# EAGLE design piezo-preamp-tickler_V3-6_single-supply-OPA1642 (EAGLE 8.6.0)

## Sheet 1 of 2
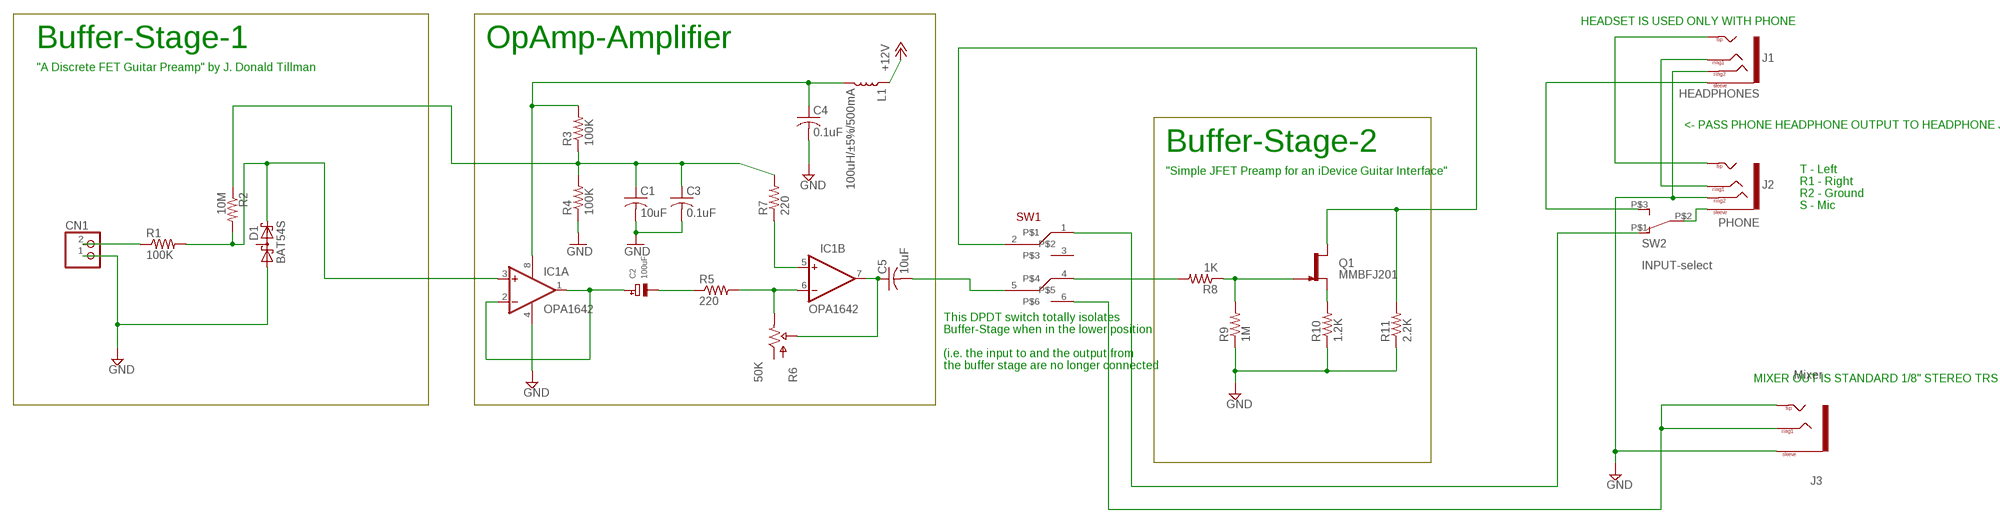
[diagram p0: schematic, sheet 1]

### Parts
C1  10uF  C-USC0805K  [C0805K]
C2  100uF  CAP_TANTALUMD/7343_REFLOW  [EIA7343-31/D-R]
C3  0.1uF  C-USC0805K  [C0805K]
C4  0.1uF  C-USC0805K  [C0805K]
C5  10uF  C-USC0805  [C0805]
CN1  JST_2PIN-THM  [JST-PH-2-THM]
D1  BAT54S  [SOT23]
IC1  OPA1642  OPA2134UA  [SO08]
J1  HEADPHONES  TRRS-1/8"-3.5MMLGPADS  [TRRS_SJ-43514-SMT-TR]
J2  PHONE  TRRS-1/8"-3.5MMLGPADS  [TRRS_SJ-43514-SMT-TR]
J3  Mixer  TRS-1/8"-3.5MM  [TRS_SJ-3524-SMT]
L1  100uH/±5%/500mA  INDUCTOR-0603-33NH  [0603]
Q1  MMBFJ201  J201SOT-23  [SOT23-3]
R1  100K  R-US_R0603  [R0603]
R2  10M  R-US_R0603  [R0603]
R3  100K  R-US_R0603  [R0603]
R4  100K  R-US_R0603  [R0603]
R5  220  R-US_R0603  [R0603]
R6  50K  POTTHUMBPOT14  [THUMBPOT14MM]
R7  220  R-US_R0603  [R0603]
R8  1K  R-US_R0603  [R0603]
R9  1M  R-US_R0603  [R0603]
R10  1.2K  R-US_R0603  [R0603]
R11  2.2K  R-US_R0603  [R0603]
SW1  SWITCH_DPDT  [SWITCH_DPDT_CL-SB-22B]
SW2  INPUT-select  SWITCH_SPDTCL-SB-12B  [SWITCH_SPDT_CL-SB-12B]

### Nets
+12V: L1.1 ; also sheet 2
GND: C1.2 C3.2 C4.2 CN1.1 D1.1(A1) IC1.4(A:V-) J1.RING2 J2.RING2 J3.1(SLEEVE) R4.1 R9.1 R10.1 R11.1 ; also sheet 2
N$1: D1.2(C2) IC1.3(A:+IN) R1.2 R2.2
N$2: CN1.2 R1.1
N$3: Q1.2(S) R10.2
N$4: J1.EARTH(SLEEVE) SW2.P$3
N$5: IC1.5(B:+IN) R7.1
N$6: C5.1 IC1.7(B:OUT) R6.P$2(WIPER)
N$7: IC1.6(B:-IN) R5.2 R6.P$3(OUT)
N$8: C4.1 IC1.8(A:V+) L1.2 R3.2
N$9: C1.1 C3.1 R2.1 R3.1 R4.2 R7.2
N$10: Q1.3(G) R8.1 R9.2
N$11: R8.2 SW1.4
N$12: J3.2(TIP) J3.3(RING1) J3.4(TIP) SW1.6
N$13: J1.RING1 J2.RING1
N$14: C2.- R5.1
N$16: C5.2 SW1.5
N$17: J2.EARTH(SLEEVE) SW2.P$2
N$19: SW1.1 SW2.P$1
N$24: C2.+ IC1.1(A:OUT) IC1.2(A:-IN)
N$33: J1.TIP J2.TIP
SELECT: Q1.1(D) R11.2 SW1.2
Unconnected: D1.3(C1A2) R6.P$1(IN) SW1.3

### Notes on the sheet
- HEADSET IS USED ONLY WITH PHONE
- Buffer-Stage-1 | OpAmp-Amplifier
- "A Discrete FET Guitar Preamp" by J. Donald Tillman
- <- PASS PHONE HEADPHONE OUTPUT TO HEADPHONE JACK
- Buffer-Stage-2
- "Simple JFET Preamp for an iDevice Guitar Interface"
- T - Left
  R1 - Right
  R2 - Ground
  S - Mic
- This DPDT switch totally isolates 
  Buffer-Stage when in the lower position
  
  (i.e. the input to and the output from 
  the buffer stage are no longer connected
- MIXER OUT IS STANDARD 1/8" STEREO TRS

## Sheet 2 of 2
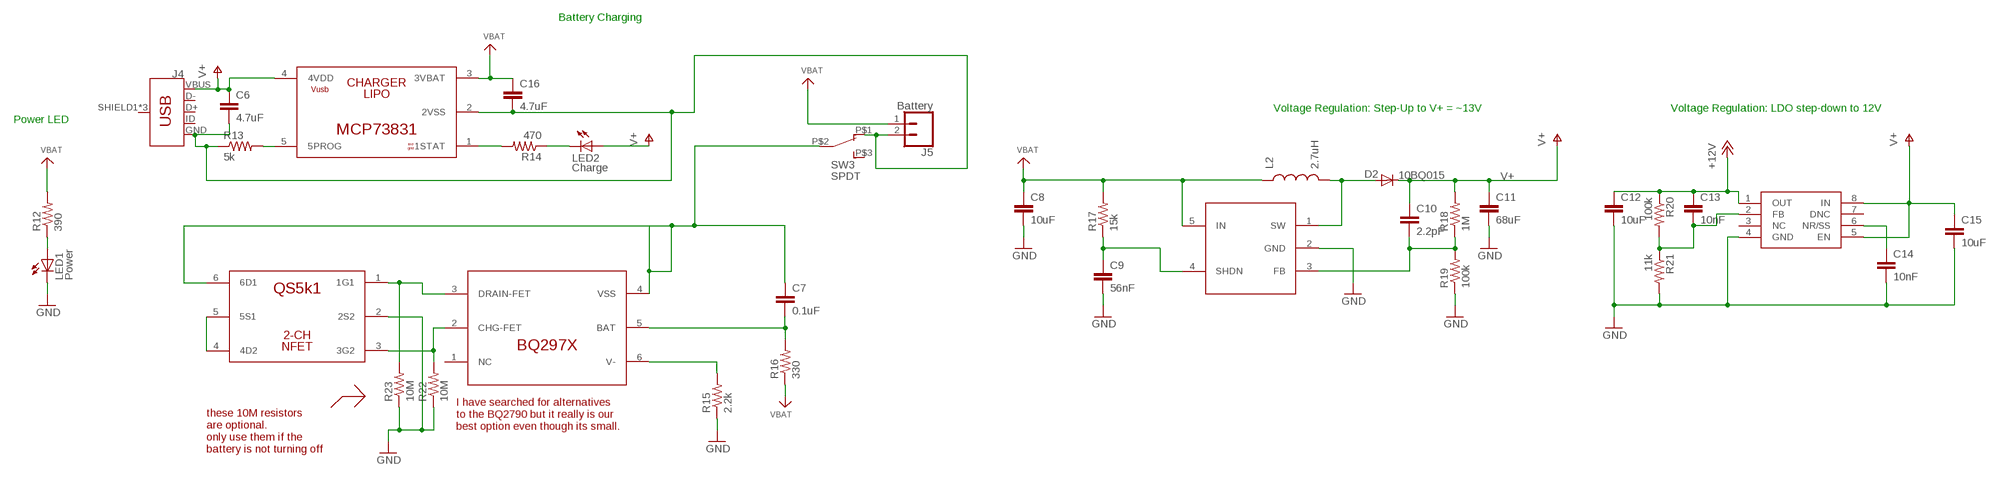
[diagram p1: schematic, sheet 2]

### Parts
C6  4.7uF  C-EUC0603  [C0603]
C7  0.1uF  C-EUC0603  [C0603]
C8  10uF  C-EUC0603  [C0603]
C9  56nF  C-EUC0603  [C0603]
C10  2.2pF  C-EUC0603  [C0603]
C11  68uF  C-EUC1206  [C1206]
C12  10uF  C-EUC0603  [C0603]
C13  10nF  C-EUC0603  [C0603]
C14  10nF  C-EUC0603  [C0603]
C15  10uF  C-EUC0603  [C0603]
C16  4.7uF  C-EUC0603  [C0603]
D2  10BQ015  DIODESMA  [SMA-DIODE]
IC4  BQ297X  BQ297X-BATTERY-MANAGERLONG  [WSON-6-LONG]
IC5  SC4503  [SOT23-5]
IC6  TPS7A49  [MSOP-8]
J4  USB_MICRO-BREDUCED_PASTE  [USB-B-MICRO-SMD_RED_PASTE]
J5  Battery  CONN_02LOCK  [1X02_LOCK]
L2  2.7uH  INDUCTOR30OHM,1.8A  [0603]
LED1  Power  LED3MM  [LED3MM]
LED2  Charge  LED3MM  [LED3MM]
R12  390  R-US_R0603  [R0603]
R13  5k  R-US_R0603  [R0603]
R14  470  R-US_R0603  [R0603]
R15  2.2k  R-US_R0603  [R0603]
R16  330  R-US_R0603  [R0603]
R17  15k  R-US_R0603  [R0603]
R18  1M  R-US_R0603  [R0603]
R19  100k  R-US_R0603  [R0603]
R20  100k  R-US_R0603  [R0603]
R21  11k  R-US_R0603  [R0603]
R22  10M  R-US_R0603  [R0603]
R23  10M  R-US_R0603  [R0603]
SW3  SPDT  SWITCH_SPDTCL-SB-12B  [SWITCH_SPDT_CL-SB-12B]
U$1  MCP73831  [SOT-23-5]
U$2  QS6K1  [SOT457R_PHILIPS]

### Nets
+12V: C12.1 C13.1 IC6.1(OUT) R20.1 ; also sheet 1
BATGND: C7.1 IC4.4(VSS) SW3.P$2 U$2.6(6D1)
GND: C8.2 C9.2 C11.2 C12.2 C14.2 C15.2 IC5.2(GND) IC6.4(GND) LED1.K(C) R15.1 R19.1 R21.2 R22.1 R23.1 U$2.2(2S2) ; also sheet 1
N$18: LED1.A R12.1
N$21: R13.2 U$1.5(5PROG)
N$22: LED2.K(C) R14.1
N$23: U$2.4(4D2) U$2.5(5S1)
N$25: R14.2 U$1.1(1STAT)
N$26: C13.2 IC6.2(FB) R20.2 R21.1
N$27: IC4.3(DRAIN-FET) R23.2 U$2.1(1G1)
N$28: C14.1 IC6.6(NR/SS)
N$29: C9.1 IC5.4(SHDN) R17.1
N$30: C10.2 IC5.3(FB) R18.1 R19.2
N$31: IC4.2(CHG-FET) R22.2 U$2.3(3G2)
N$32: D2.A IC5.1(SW) L2.2
N$34: IC4.6(V-) R15.2
N$42: C7.2 IC4.5(BAT) R16.2
USBGND: C6.2 C16.2 J4.GND J5.2 R13.1 SW3.P$1 U$1.2(2VSS)
V+: C6.1 C10.1 C11.1 C15.1 D2.C IC6.5(EN) IC6.8(IN) J4.VBUS LED2.A R18.2 U$1.4(4VDD)
VBAT: C8.1 C16.1 IC5.5(IN) J5.1 L2.1 R12.2 R16.1 R17.2 U$1.3(3VBAT)
Unconnected: IC4.1(NC) IC6.3(NC) IC6.7(DNC) J4.D+ J4.D- J4.ID J4.SHIELD1(SHIELD) J4.SHIELD2(SHIELD) J4.SHIELD3(SHIELD) SW3.P$3

### Notes on the sheet
- Battery Charging
- Voltage Regulation: Step-Up to V+ = ~13V | Voltage Regulation: LDO step-down to 12V
- Power LED
- I have searched for alternatives 
  to the BQ2790 but it really is our 
  best option even though its small.
- these 10M resistors
  are optional. 
  only use them if the 
  battery is not turning off

## Library data of the parts
C1 C3-C5 = adafruit:C-US: CAPACITOR, American symbol
C2 = microbuilder:CAP_TANTALUM: Tantalum Capacitors Wave footprints have larger pads and are meant to be used for hand soldering. Reflow footprints are optimised for solder paste and a reflow oven. EIA3216-18/A-[R/W] - Size A / 3216-18 / 1206 footprint 4.7µF 25V 10% Tantalum Capacitor 10µF 16V 10% Tantalum Capacitor [Digikey: 495-2236-2-ND] EIA3528-21/B-[R/W] - Size B / 3528-21 47µF 10V 10% Tantalum Capactior [Digikey: 495-2216-1-ND] EIA6032-28/C-[R/W] - Size C / 6032-28 10µF 35V 20% Tantalum Capacitor [Digikey: 495-2285-1-ND] 100µF 16V 10% Tantalum Capactior [Digikey: 399-5214-1-ND]
C6-C16 = rcl:C-EU: CAPACITOR, European symbol; SPICEPREFIX: C
CN1 = adafruit:JST_2PIN: JST 2-Pin Connectors of various flavors SMT-RA (S2B-PH-SM4) 4UConnector #17311 SMT (B2B-PH-SM4) THM-RA (S2B-PH) THM (B2B-PH)
D1 = diode:BAT54S: Schottky Diodes Pin connection corrected 2011-05-04 Source: Fairchild .. BAT54.pdf
D2 = SparkFun:DIODE: Diode These are standard reverse protection diodes and small signal diodes. SMA package can handle up to about 1A. SOD-323 can handle about 200mA. What the SOD-323 package when ordering, there are some mfgs out there that are 5-pin packages.
IC1 = linear:OPA2*: Dual Operational Amplifier Low Power, Single-Supply, Rail-To-Rail Operational Amplifier Source: http://focus.ti.com/lit/ds/symlink/opa2345.pdf http://focus.ti.com .. opa241.pdf http://focus.ti.com/lit/ds/symlink/opa2134.pdf
IC4 = CMU-ArtFab:BQ297X-BATTERY-MANAGER
IC5 = CMU-ArtFab:SC4503
IC6 = CMU-ArtFab:TPS7A49
J1 J2 = CMU-ArtFab:TRRS-1/8"-3.5MM: Audio jack - 3.5mm TRRS variety - two rings.
J3 = CMU-ArtFab:TRS-1/8"-3.5MM
J4 = CMU-ArtFab:USB_MICRO-B: USB Type Micro-B Connector Male/female and PTH/SMT variants SparkFun Products: SparkFun microB USB Breakout <https://www.sparkfun.com/products/12035> SparkFun USB microB Plug Breakout <https://www.sparkfun.com/products/10031> SparkFun ESP8266 Thing <https://www.sparkfun.com/products/13231>; PROD_ID: CONN-11752
J5 = SparkFun-Connectors:CONN_02: Multi connection point. Often used as Generic Header-pin footprint for 0.1 inch spaced/style header connections On any of the 0.1 inch spaced packages, you can populate with these: Break Away Headers - Straight <https://www.sparkfun.com/products/116> (PRT-00116) Break Away Male Headers - Right Angle <https://www.sparkfun.com/products/553> (PRT-00553) Female Headers <https://www.sparkfun.com/products/115> (PRT-00115) Break Away Headers - Machine Pin <https://www.sparkfun.com/products/117> (PRT-00117) Break Away Female Headers - Swiss Machine Pin <https://www.sparkfun.com/products/743> (PRT-00743) For SCREWTERMINALS and SPRING TERMINALS visit here: Screw Terimnals on SparkFun.com <https://www.sparkfun.com/search/results?term=Screw+Terminals> (5mm/3.5mm/2.54mm spacing) This device is also useful as a general connection point to wire up your design to another part of your project. Our various solder wires solder well into these plated through hole pads. Hook-Up Wire - Assortment (Stranded, 22 AWG) <https://www.sparkfun.com/products/11375> (PRT-11375) Hook-Up Wire - Assortment (Solid Core, 22 AWG) <https://www.sparkfun.com/products/11367> (PRT-11367) View the entire wire category on our website here <https://www.sparkfun.com/categories/141> Special notes: Molex polarized connector foot print use with: PRT-08233 with associated crimp pins and housings. 2.54_SCREWTERM for use with PRT-10571. 3.5mm Screw Terminal footprints for PRT-08084 5mm Screw Terminal footprints for use with PRT-08432
L1 = SparkFun-Coils:INDUCTOR: Inductors; PROD_ID: NDUC-07874; VALUE: 33nH/±5%/500mA
L2 = SparkFun-Passives:INDUCTOR: Inductors; PROD_ID: RES-07859
LED1 LED2 = led:LED: LED OSRAM: - CHIPLED LG R971, LG N971, LY N971, LG Q971, LY Q971, LO R971, LY R971 LH N974, LH R974 LS Q976, LO Q976, LY Q976 LO Q996 - Hyper CHIPLED LW Q18S LB Q993, LB Q99A, LB R99A - SideLED LS A670, LO A670, LY A670, LG A670, LP A670 LB A673, LV A673, LT A673, LW A673 LH A674 LY A675 LS A676, LA A676, LO A676, LY A676, LW A676 LS A679, LY A679, LG A679 - Hyper Micro SIDELED® LS Y876, LA Y876, LO Y876, LY Y876 LT Y87S - SmartLED LW L88C, LW L88S LB L89C, LB L89S, LG L890 LS L89K, LO L89K, LY L89K LS L896, LA L896, LO L896, LY L896 - TOPLED LS T670, LO T670, LY T670, LG T670, LP T670 LSG T670, LSP T670, LSY T670, LOP T670, LYG T670 LG T671, LOG T671, LSG T671 LB T673, LV T673, LT T673, LW T673 LH T674 LS T676, LA T676, LO T676, LY T676, LB T676, LH T676, LSB T676, LW T676 LB T67C, LV T67C, LT T67C, LS T67K, LO T67K, LY T67K, LW E67C LS E67B, LA E67B, LO E67B, LY E67B, LB E67C, LV E67C, LT E67C LW T67C LS T679, LY T679, LG T679 LS T770, LO T770, LY T770, LG T770, LP T770 LB T773, LV T773, LT T773, LW T773 LH T774 LS E675, LA E675, LY E675, LS T675 LS T776, LA T776, LO T776, LY T776, LB T776 LHGB T686 LT T68C, LB T68C - Hyper Mini TOPLED® LB M676 - Mini TOPLED Santana® LG M470 LS M47K, LO M47K, LY M47K Source: http://www.osram.convergy.de LUXEON: - LUMILED® LXK2-PW12-R00, LXK2-PW12-S00, LXK2-PW14-U00, LXK2-PW14-V00 LXK2-PM12-R00, LXK2-PM12-S00, LXK2-PM14-U00 LXK2-PE12-Q00, LXK2-PE12-R00, LXK2-PE12-S00, LXK2-PE14-T00, LXK2-PE14-U00 LXK2-PB12-K00, LXK2-PB12-L00, LXK2-PB12-M00, LXK2-PB14-N00, LXK2-PB14-P00, LXK2-PB14-Q00 LXK2-PR12-L00, LXK2-PR12-M00, LXK2-PR14-Q00, LXK2-PR14-R00 LXK2-PD12-Q00, LXK2-PD12-R00, LXK2-PD12-S00 LXK2-PH12-R00, LXK2-PH12-S00 LXK2-PL12-P00, LXK2-PL12-Q00, LXK2-PL12-R00 Source: www.luxeon.com KINGBRIGHT: KA-3528ASYC Source: www.kingbright.com
Q1 = CMU-ArtFab:J201: N-channel JFET
R1-R5 R7-R23 = CMU-ArtFab:R-US_: RESISTOR, American symbol
R6 = CMU-ArtFab:POT: http://www.taydaelectronics.com/10k-ohm-linear-taper-potentiometer-round-shaft-pcb-9mm.html http://www.taydaelectronics.com/datasheets/A-1847.pdf
SW1 = CMU-ArtFab:SWITCH_DPDT
SW2 SW3 = CMU-ArtFab:SWITCH_SPDT
U$1 = CMU-ArtFab:MCP73831
U$2 = CMU-ArtFab:QS6K1

## Board
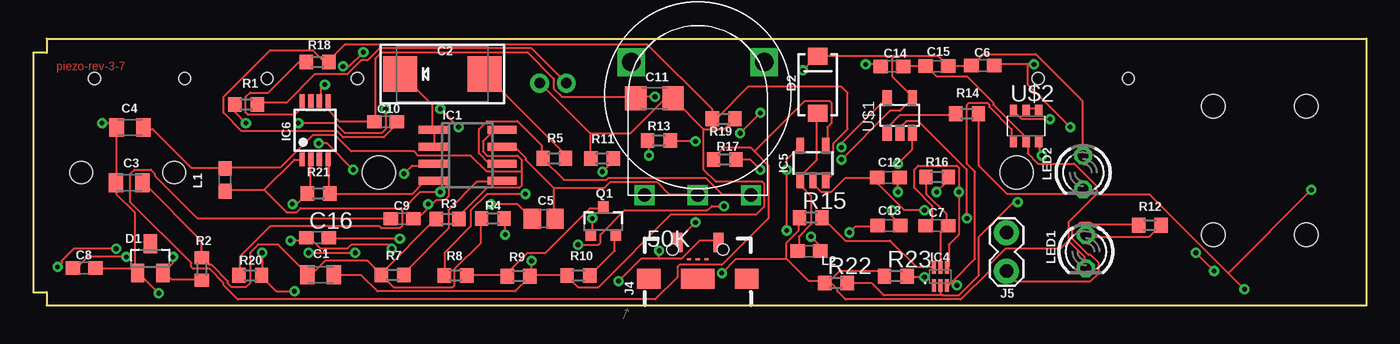
[diagram p2: board, top side]
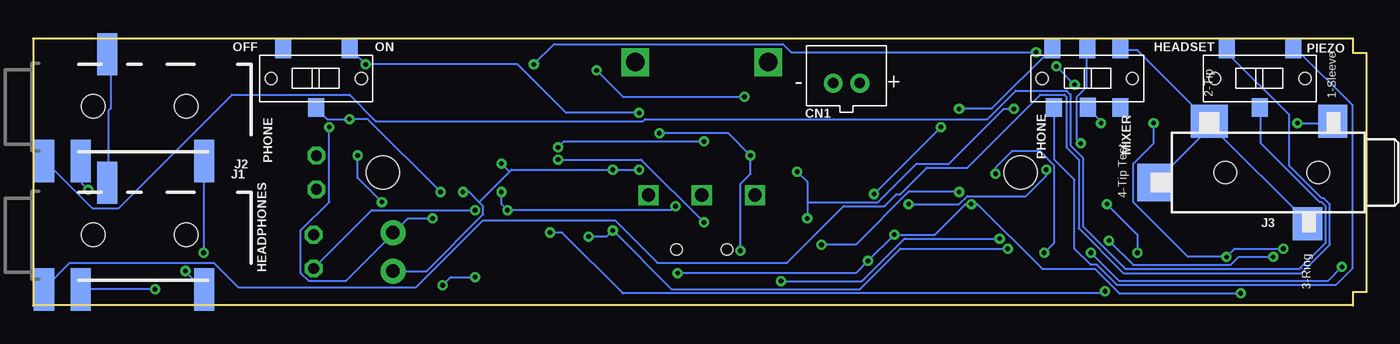
[diagram p3: board, bottom side, seen from below]

Size 100.3 x 20.07 mm. Coordinates in mm from the lower left corner, seen from the top.
Outline: 0,19 0,1 1.02,1 1.02,0 100.3,0 100.3,20.07 1,20.07 1,19 0,19
Copper layers (1*16): Top 0.035mm / dielectric 1.5mm / Bottom 0.035mm
Design rules "default *": minimum track width 6mil, minimum drill 0.35mm, track to track 6mil, track to pad 6mil, pad to pad 6mil, via to via 6mil, smd to smd 6mil, copper to edge 8mil, drill to drill 6mil, minimum pad ring 10mil, minimum via ring 8mil, stop-mask expansion 4mil, vias tented up to drill 20mil, thermal gap 10mil
Holes 2.5 mm at 74,10 26,10

### Footprints (pad centres in the part's own frame; a part is rotated, then mirrored left to right if it is on the bottom)
C0805K = smd 1.1 x 1.4: 1 -1,0; 2 1,0
EIA7343-31/D-R = smd 2.55 x 2.7: + 3.175,0; - -3.175,0
C0805 = smd 1.3 x 1.5: 1 -0.85,0; 2 0.85,0
C0603 = smd 1.1 x 1: 1 -0.85,0; 2 0.85,0
C1206 = smd 1.6 x 1.8: 1 -1.4,0; 2 1.4,0
JST-PH-2-THM = drill 0.8 pad 1.422: 1 1,0; 2 -1,0
SOT23 = smd 1 x 1.4: 1 -0.95,-1.1; 2 0.95,-1.1; 3 0,1.1
SMA-DIODE = smd 1.27 x 1.47: A -2.15,0; C 2.15,0
SO08 = smd 0.6 x 2.2: 1 -1.905,-2.6; 2 -0.635,-2.6; 3 0.635,-2.6; 4 1.905,-2.6; 5 1.905,2.6; 6 0.635,2.6; 7 -0.635,2.6; 8 -1.905,2.6
WSON-6-LONG = smd 0.3 x 0.954: 1 -0.5,-0.686; 2 0,-0.686; 3 0.5,-0.686; 4 0.5,0.686; 5 0,0.686; 6 -0.5,0.686
SOT23-5 = smd 0.55 x 1.2: 1 -0.95,-1.3; 2 0,-1.3; 3 0.95,-1.3; 4 0.95,1.3; 5 -0.95,1.3
MSOP-8 = smd 0.4 x 1: 1 -0.975,-2.2; 2 -0.325,-2.2; 3 0.325,-2.2; 4 0.975,-2.2; 5 0.975,2.2; 6 0.325,2.2; 7 -0.325,2.2; 8 -0.975,2.2
TRRS_SJ-43514-SMT-TR = smd 1.524 x 3.175: EARTH -7.067,-4.128; RING1 -2.309,3.901; RING2 -4.293,-4.128; TIP 4.995,-4.128 | hole 1.778: -3.353,-0.007; 3.647,-0.007
TRS_SJ-3524-SMT = smd 2.5 x 2.2: 1 3.85,-4.6; 3 -3.85,-2.7 | smd 2.5 x 2.8: 2 3.85,4.7 | smd 2.8 x 2.5: 4 -0.75,8.85 | hole 1.7: 0,-3.5; 0,3.5
USB-B-MICRO-SMD_RED_PASTE = smd 0.152 x 0.305: D+ 1.455,0; D- 1.455,0.65; ID 1.455,-0.65 | smd 1.45 x 0.762: GND 2.725,-1.554 | smd 1.5 x 1.8: SHIELD1 0,3.685; SHIELD2 0,-3.685 | smd 1.5 x 2.5: SHIELD3 0,0 | smd 1.45 x 0.781: VBUS 2.725,1.554 | hole 0.85: 2.2,1.9; 2.2,-1.9
1X02_LOCK = drill 1.016 pad 1.88: 1 -0.178,0; 2 2.718,0
0603 = smd 1.1 x 1: 1 -0.85,0; 2 0.85,0
LED3MM = drill 0.813 octagon: A -1.27,0; K 1.27,0
SOT23-3 = smd 0.8 x 0.9: 1 -0.95,-1; 2 0.95,-1; 3 0,1.1
R0603 = smd 1 x 1.1: 1 -0.85,0; 2 0.85,0
THUMBPOT14MM = drill 1 square: P$1 -4,-7.5; P$2 0,-7.5; P$3 4,-7.5 | drill 1.4 square: P$4 -5,2.5; P$5 5,2.5
SWITCH_DPDT_CL-SB-22B = smd 1.2 x 1.4: 1 -2.5,-2.2; 2 0.05,-2.17; 3 2.5,-2.2; 4 -2.63,2.2; 5 0,2.2; 6 2.51,2.2 | hole 0.9: -3.4,0; 3.4,0
SWITCH_SPDT_CL-SB-12B = smd 1.2 x 1.4: P$1 -2.5,-2.2; P$2 0,2.2; P$3 2.5,-2.2 | hole 0.9: -3.4,0; 3.4,0
SOT-23-5 = smd 0.69 x 1.2: 1 -0.95,-1.3; 2 0,-1.3; 3 0.95,-1.3; 4 0.95,1.3; 5 -0.95,1.3
SOT457R_PHILIPS = smd 0.55 x 0.8: 1 -0.95,-1.2; 2 0,-1.2; 3 0.95,-1.2; 4 0.95,1.2; 5 0,1.2; 6 -0.95,1.2

### Placement (x,y rotation side)
C1  21.62,2.31 0 top
C2  30.78,17.41 180 top
C3  7.23,9.23 180 top
C4  7.29,13.38 180 top
C5  38.41,6.53 180 top
C6  71.44,18.04 0 top
C7  68,6 0 top
C8  3.83,2.81 0 top
C9  27.76,6.52 0 top
C10  26.51,13.81 0 top
C11  46.73,15.6 0 top
C12  64.35,9.63 180 top
C13  64.39,6.02 180 top
C14  64.62,17.98 0 top
C15  68,18 180 top
C16  21.4,5.1 0 top
CN1  39.11,16.72 0 bottom
D1  8.81,3.54 0 top
D2  59.04,16.61 90 top
IC1  32.68,11.3 270 top
IC4  68.25,2.19 0 top
IC5  58.67,10.72 0 top
IC6  21.21,13.18 0 top
J1  92.43,5.33 0 bottom
J2  92.43,14.99 0 bottom
J3  7.11,10 90 bottom
J4  50,2.02 90 top
J5  73.23,2.75 90 top
L1  14.44,9.44 90 top
L2  58.37,4.09 180 top
LED1  79.2,4.05 270 top
LED2  79,10 270 top
Q1  42.9,6.3 0 top
R1  16.03,15.11 180 top
R2  12.68,2.74 270 top
R3  31.18,6.51 0 top
R4  34.58,6.54 180 top
R5  39.2,11.07 180 top
R6  50,15.8 0 top
R7  27.04,2.31 180 top
R8  31.78,2.26 180 top
R9  36.52,2.2 180 top
R10  41.02,2.24 0 top
R11  42.79,11.07 0 top
R12  84.02,6.03 180 top
R13  47.08,12.41 0 top
R14  70.26,14.42 180 top
R15  58.5,6.6 0 top
R16  68.01,9.66 180 top
R17  52.03,10.98 0 top
R18  21.39,18.31 180 top
R19  51.95,14.04 180 top
R20  16.34,2.27 0 top
R21  21.47,8.42 0 top
R22  60.4,1.7 0 top
R23  64.9,2.2 0 top
SW1  21,17.08 0 bottom
SW2  8,17.08 180 bottom
SW3  79,17.08 180 bottom
U$1  65.2,14.3 0 top
U$2  74.7,13.5 0 top

### Tracks (layer width: path | path; a pad name or v marks a point on that pad's centre or on a via)
+12V  (via drill 0.35)
  Top 0.152: v65.08,8.53 65.08,9.6 C12.1 | v64.62,7.16 64.62,6.71 65.23,6.1 C13.1 | 17.37,8.69 19.66,10.97 20.12,10.97 IC6.1 | 17.37,8.69 14.48,8.69 L1.1 | 27.74,7.16 27.74,5.94 27.58,5.79 26.21,5.79 26.06,5.94 17.83,5.94 15.54,3.66 15.54,2.29 R20.1 | 27.74,7.16 27.58,7.32 20.12,7.32 19.81,7.01 19.05,7.01 17.37,8.69 | v51.97,7.47 51.05,7.47 50.75,7.16 44.5,7.16 42.67,5.33 42.67,4.72 42.52,4.57 v41,4.57 | v30.63,8.53 29.11,8.53 27.74,7.16
  Bottom 0.152: v65.08,8.53 65.08,7.62 v64.62,7.16 52.27,7.16 v51.97,7.47 | v41,4.57 38.41,4.57 34.44,8.53 v30.63,8.53
BATGND  (via drill 0.35)
  Top 0.152: v76.5,14.02 74.37,14.02 73.76,14.63 U$2.6 | IC4.4 68.89,2.9 68.89,4.57 69.65,5.33 v69.65,8.53 69.65,10.36 69.49,10.52 66.6,10.52 66.29,10.21 66.29,8.84 67.67,7.47 67.67,6.55 67.21,6.1 C7.1
  Bottom 0.152: SW3.P$2 78.94,14.78 78.18,14.02 v76.5,14.02 75.13,14.02 v69.65,8.53
GND  (via drill 0.35)
  Top 0.152: 59.89,1.83 59.59,1.83 R22.1 | 59.89,1.83 60.66,2.59 63.7,2.59 64.01,2.29 R23.1 | 56.69,3.5 56.69,4.72 57.61,5.64 57.61,6.55 R15.1 | 56.69,3.5 58.37,1.83 59.44,1.83 R22.1 | IC5.2 58.52,9.3 59.28,8.53 60.05,8.53 61.11,9.6 63.4,9.6 C12.2 63.55,9.6 63.55,9.14 65.53,7.16 v67.06,7.16 | C14.2 65.53,17.98 67.06,17.98 C15.2 67.21,17.98 67.97,17.22 70.26,17.22 72.24,15.24 72.24,15.09 74.68,12.65 74.68,12.34 U$2.2 74.83,12.19 74.83,11.43 75.59,10.67 78.33,10.67 80.01,8.99 80.01,8.38 | 77.88,4.88 79.1,3.66 79.1,2.9 LED1.K | 77.88,4.88 77.88,6.25 80.01,8.38 | 89.92,2.44 83.97,8.38 80.01,8.38 | 89.92,2.44 v91.14,1.22 | 89.92,2.44 v96.16,8.69 | 59.89,1.83 60.5,1.22 60.5,1.07 61.11,0.46 69.8,0.46 71.93,2.59 71.93,3.05 73.15,4.27 77.27,4.27 77.88,4.88 | 59.89,1.83 R22.1 | 50.44,13.26 51.97,13.26 52.73,14.02 R19.1 | 50.44,13.26 48.16,15.54 C11.2 48.01,15.54 47.55,15.54 44.96,12.95 41.91,12.95 | 41.91,12.95 41.91,11.12 R11.1 | 41.91,12.95 38.25,16.61 CN1.1 | 7.62,2.74 4.72,2.74 C8.2 | 7.62,2.74 7.77,2.59 D1.1 | 7.62,2.74 7.62,7.01 6.25,8.38 6.25,9.14 C3.2 6.25,9.3 6.25,13.26 C4.2 6.25,13.41 5.94,13.72 v5.18,13.72 | 7.62,2.74 D1.1 | IC6.4 22.25,10.97 22.25,8.53 R21.2 22.4,8.38 28.5,8.38 29.41,9.3 30.02,9.3 IC1.4 30.18,9.3 30.79,9.3 31.24,8.84 31.24,8.23 30.94,7.92 30.33,7.92 29.87,7.47 | 29.87,7.47 28.96,6.55 28.65,6.55 C9.2 | 37.49,2.29 40.08,2.29 R10.1 40.23,2.13 41,1.37 42.52,1.37 48.01,6.86 54.41,6.86 55.02,7.47 55.02,9.14 54.86,9.3 51.36,9.3 50.44,10.21 50.44,13.26 | v35.51,5.33 35.51,6.4 R4.1 | 37.49,2.29 v37.49,3.35 | 37.49,2.29 R9.1 37.34,2.13 36.27,1.07 25.91,1.07 24.69,2.29 22.71,2.29 C1.2
  Top 0.152: v29.72,7.62 29.87,7.47 | v9.45,0.91 7.92,2.44 D1.1 | 56.69,3.5 52.88,3.5 v51.82,2.44
  Bottom 0.152: v67.06,7.16 74.83,7.16 79.1,2.9 LED1.K | v91.14,1.22 96.62,1.22 J1.RING2 | v96.16,8.69 96.62,9.14 96.62,10.82 J2.RING2 | v5.18,13.72 2.59,13.72 J3.1 | v9.45,0.91 18.59,0.91 20.42,2.74 24.38,2.74 29.26,7.62 v29.72,7.62 30.18,7.62 32.46,5.33 v35.51,5.33 v37.49,3.35 38.41,2.44 v51.82,2.44
N$1  (via drill 0.35)
  Top 0.152: R2.2 12.65,1.98 10.36,1.98 9.91,2.44 D1.2 9.91,2.59 10.52,3.2 v10.52,3.66 | v16,13.72 15.24,14.48 15.24,15.09 R1.2 | v27.89,9.91 28.5,10.52 30.02,10.52 IC1.3 | v20.73,3.96 v24.23,3.96 | v1.83,2.9 2.13,3.2 2.13,3.35 3.05,4.27 v6.25,4.27
  Bottom 0.152: v16,13.72 16,12.19 17.53,10.67 17.53,7.77 13.41,3.66 v10.52,3.66 9.91,4.27 v6.25,4.27 | v27.89,9.91 27.89,10.36 26.67,11.58 24.54,11.58 23.47,10.52 23.47,4.72 v24.23,3.96 | v20.73,3.96 18.59,1.83 2.9,1.83 v1.83,2.9
N$2
  Top 0.152: R1.1 16.92,15.24 19.05,15.24 21.18,17.37 23.62,17.37 24.69,18.44 25.15,18.44 26.06,19.36 37.49,19.36 40.08,16.76 CN1.2
N$3
  Top 0.152: Q1.2 43.74,5.18 43.74,4.12 41.91,2.29 R10.2
N$4
  Bottom 0.152: SW2.P$3 10.36,19.2 10.36,18.9 5.79,14.33 5.79,10.52 3.35,8.08 3.2,8.08 2.74,7.62 2.74,4.57 4.88,2.44 18.29,2.44 21.64,5.79 21.64,10.97 22.55,11.89 22.55,15.7 22.71,15.85 24.54,15.85 30.02,10.36 33.07,10.36 35.05,8.38 35.36,8.38 36.27,7.47 39.32,7.47 43.59,3.2 53.34,3.2 56.54,6.4 66.45,6.4 71.48,1.37 84.89,1.37 86.72,3.2 97.54,3.2 99.52,1.22 J1.EARTH
N$5
  Top 0.152: R7.1 27.89,2.44 31.24,5.79 31.24,7.16 33.38,9.3 35.2,9.3 IC1.5
N$6
  Top 0.152: 39.17,8.84 39.17,6.55 C5.1 | 39.17,8.84 37.03,10.97 37.03,11.12 36.27,11.89 35.36,11.89 IC1.7 | 39.17,8.84 42.98,8.84 43.43,9.3 46.94,9.3 47.85,8.38 49.99,8.38 R6.P$2
N$7
  Top 0.152: IC1.6 35.2,10.67 34.29,10.67 33.53,11.43 33.53,13.26 34.14,13.87 36.42,13.87 38.25,12.04 38.25,11.12 R5.2 38.41,10.97 39.93,9.45 43.13,9.45 43.28,9.6 50.6,9.6 51.82,8.38 53.95,8.38 R6.P$3
N$8
  Top 0.152: C4.1 8.38,13.26 8.99,13.26 11.89,10.36 14.33,10.36 L1.2 14.48,10.36 18.59,10.36 21.03,12.8 22.71,12.8 23.93,11.58 28.65,11.58 28.96,11.28 32.92,11.28 34.14,10.06 36.73,10.06 | 36.73,10.06 36.73,10.97 36.42,11.28 34.14,11.28 33.83,11.58 33.83,12.34 34.59,13.11 35.2,13.11 IC1.8 | 36.73,10.06 36.73,8.99 36.58,8.84 34.14,8.84 32.16,6.86 32.16,6.55 R3.2
N$9
  Top 0.152: C3.1 8.38,9.14 12.65,4.88 12.65,3.66 R2.1 12.8,3.5 13.26,3.05 13.41,3.05 14.63,1.83 14.63,1.68 14.94,1.37 16,1.37 16.31,1.68 16.31,3.96 16.92,4.57 18.44,4.57 20.57,2.44 C1.1 20.73,2.44 21.03,2.44 21.95,3.35 25.15,3.35 26.06,2.44 R7.2 | R7.2 26.21,2.44 30.33,6.55 R3.1 | R4.2 33.68,6.4 33.68,4.72 31.7,2.74 31.7,1.52 31.55,1.37 27.13,1.37 26.21,2.29 R7.2
N$10
  Top 0.152: Q1.3 42.82,7.32 41.91,7.32 38.56,3.96 37.19,3.96 35.81,2.59 35.81,2.29 R9.2 35.66,2.29 32.77,2.29 R8.1
N$11  (via drill 0.35)
  Top 0.152: v37.03,8.38 34.14,8.38 32.92,7.16 32.92,5.94 30.94,3.96 30.94,2.29 R8.2 | v30.63,14.78 v32,13.41
  Bottom 0.152: v32,13.41 v37.03,8.38 | v30.63,14.78 28.19,14.78 23.77,19.2 SW1.4
N$12
  Bottom 0.152: SW1.6 18.44,19.2 17.22,19.2 11.89,13.87 J3.2 | 11.58,13.41 11.89,13.72 J3.2 | 11.58,13.41 4.42,6.25 J3.3 | 11.58,13.41 11.73,13.41 15.85,9.3 J3.4 | 11.58,13.41 J3.2
N$13
  Bottom 0.152: J1.RING1 94.64,9.3 94.64,14.63 94.49,14.78 94.49,18.59 94.64,18.75 J2.RING1
N$14
  Top 0.152: R5.1 39.93,11.12 39.93,11.43 33.98,17.37 C2.-
N$16  (via drill 0.35)
  Top 0.152: v21.49,12.19 22.1,12.19 v24.08,10.21 | v34.44,7.62 36.42,7.62 37.49,6.55 C5.2
  Bottom 0.152: v21.49,12.19 21.79,12.5 21.79,15.7 21.03,16.46 21.03,19.2 SW1.5 | v24.08,10.21 24.08,9.75 25.6,8.23 30.02,8.23 30.63,7.62 v34.44,7.62
N$17
  Bottom 0.152: SW2.P$2 7.92,14.78 7.92,12.19 3.5,7.77 3.35,7.77 3.05,7.47 3.05,4.72 5.03,2.74 18.14,2.74 21.34,5.94 21.34,11.12 22.25,12.04 22.25,15.85 22.55,16.15 26.36,16.15 28.5,14.02 54.25,14.02 54.41,13.87 74.52,13.87 76.5,15.85 85.34,15.85 93.88,7.32 95.86,7.32 99.36,10.82 J2.EARTH
N$18
  Top 0.152: R12.1 84.73,5.94 83.97,5.18 79.25,5.18 LED1.A
N$19
  Bottom 0.152: SW1.1 23.47,14.78 23.47,10.97 21.95,9.45 21.95,4.27 20.73,3.05 20.27,3.05 18.75,1.52 2.29,1.52 1.07,2.74 1.07,15.09 5.18,19.2 5.49,19.2 SW2.P$1
N$21  (via drill 0.35)
  Top 0.152: v49.84,12.34 48.01,12.34 R13.2 | v60.81,11.89 60.81,12.19 64.16,15.54 U$1.5
  Bottom 0.152: v49.84,12.34 60.35,12.34 v60.81,11.89
N$22
  Top 0.152: R14.1 71.17,14.33 71.17,10.52 73.3,8.38 78.64,8.38 78.94,8.69 LED2.K
N$23
  Top 0.152: U$2.5 74.83,14.78 75.59,14.78 U$2.4
N$24
  Top 0.152: IC1.2 30.18,12.04 30.18,13.11 IC1.1 30.02,13.26 30.02,15.09 27.74,17.37 C2.+
N$25
  Top 0.152: R14.2 69.34,14.33 65.23,14.33 64.31,13.41 64.31,13.11 U$1.1
N$26  (via drill 0.35)
  Top 0.152: IC6.2 20.88,8.69 20.73,8.53 R21.1 20.57,8.38 19.81,7.62 v19.51,7.62 | v17.22,3.96 17.22,2.29 R20.2 17.22,2.13 18.29,1.07 v19.66,1.07 | v61.42,5.49 61.87,5.94 63.4,5.94 C13.2
  Bottom 0.152: v17.22,3.96 17.22,5.33 v19.51,7.62 | v61.42,5.49 60.5,5.49 55.93,0.91 19.81,0.91 v19.66,1.07
N$27  (via drill 0.35)
  Top 0.152: 69.19,1.83 68.89,1.52 IC4.3 | 69.19,1.83 70.87,3.5 70.87,10.06 70.26,10.67 70.26,15.09 70.41,15.24 71.78,15.24 71.93,15.09 71.93,14.94 73.61,13.26 73.61,12.34 U$2.1 | v67.06,2.13 65.84,2.13 R23.2 | 69.19,1.83 v69.49,1.52
  Bottom 0.152: v67.06,2.13 68.89,2.13 v69.49,1.52
N$28  (via drill 0.35)
  Top 0.152: v21.95,16.61 21.64,16.31 21.64,15.39 IC6.6 | v23.32,17.98 23.77,17.98 v24.84,19.05 | v62.64,18.14 63.55,18.14 63.7,17.98 C14.1
  Bottom 0.152: v23.32,17.98 v21.95,16.61 | v24.84,19.05 43.28,19.05 43.89,19.66 61.11,19.66 v62.64,18.14
N$29
  Top 0.152: 54.25,11.58 53.95,11.89 51.97,11.89 51.21,11.12 R17.1 | 54.25,11.58 55.32,10.52 55.32,6.55 51.82,3.05 48.62,3.05 48.46,2.9 48.46,2.13 46.79,0.46 15.39,0.46 14.33,1.52 14.33,1.68 13.26,2.74 12.04,2.74 11.89,2.9 11.89,3.2 7.32,7.77 7.32,9.91 7.62,10.21 8.84,10.21 9.14,9.91 9.14,9.75 12.34,6.55 26.82,6.55 C9.1 | 54.25,11.58 58.06,15.39 59.89,15.39 60.05,15.24 60.05,13.72 59.74,13.41 59.74,12.04 IC5.4
N$30
  Top 0.152: IC5.3 59.74,9.45 60.2,9.91 60.2,12.19 61.27,13.26 61.27,16 60.81,16.46 53.8,16.46 51.51,14.17 51.21,14.17 R19.2 51.05,14.17 51.05,14.78 46.18,19.66 23.47,19.66 22.25,18.44 R18.1 22.1,18.44 21.79,18.44 21.03,19.2 17.83,19.2 14.33,15.7 14.33,14.48 15.7,13.11 22.86,13.11 23.32,12.65 26.36,12.65 27.43,13.72 C10.2
N$31  (via drill 0.35)
  Top 0.152: v75.89,11.28 75.74,11.43 75.74,12.19 U$2.3 | v74.07,7.77 73.76,7.77 71.17,5.18 71.17,2.29 69.65,0.76 68.43,0.76 | 68.43,0.76 68.28,0.91 68.28,1.37 IC4.2 | 68.43,0.76 64.01,0.76 63.09,1.68 61.27,1.68 R22.2
  Bottom 0.152: v75.89,11.28 75.89,9.6 v74.07,7.77
N$32
  Top 0.152: L2.2 57.61,4.12 57.61,5.18 58.52,6.1 58.52,8.23 57.76,8.99 57.76,9.3 IC5.1 57.76,9.45 57.76,9.75 58.98,10.97 58.98,14.33 D2.A
N$33  (via drill 0.35)
  Top 0.152: v87.48,3.96 v88.85,2.59
  Bottom 0.152: v88.85,2.59 87.48,1.22 J1.TIP | v87.48,3.96 87.48,10.82 J2.TIP
N$34
  Top 0.152: IC4.6 67.67,2.9 66.45,2.9 64.47,4.88 61.11,4.88 59.44,6.55 R15.2
N$42
  Top 0.152: IC4.5 68.28,2.9 68.28,5.49 68.73,5.94 C7.2 68.73,6.1 68.73,6.86 67.21,8.38 67.21,9.6 R16.2
SELECT  (via drill 0.35)
  Top 0.152: v42.06,6.55 42.06,5.33 Q1.1 | v42.82,10.06 43.74,10.97 R11.2 | v19.96,13.72 22.71,13.72 23.47,12.95 26.21,12.95 26.52,13.26 v26.52,14.78
  Bottom 0.152: 42.06,7.77 42.06,9.3 v42.82,10.06 | 42.06,7.77 v42.06,6.55 | v19.96,13.72 19.96,13.87 20.88,14.78 SW1.2 | v26.52,14.78 27.28,14.78 31.39,10.67 33.83,10.67 36.73,7.77 42.06,7.77
USBGND  (via drill 0.35)
  Top 0.152: v75.29,18.14 74.83,18.14 | 74.83,18.14 72.39,18.14 C6.2 | v70.26,6.55 70.26,10.21 66.6,13.87 65.68,13.87 65.23,13.41 65.23,13.11 U$1.2 | 74.83,18.14 74.83,16.61 v78.03,13.41 | v27.58,5.03 22.25,5.03 C16.2 | v44.04,1.83 45.72,3.5 47.09,3.5 | 47.09,3.5 48.77,3.5 50.14,4.88 51.51,4.88 J4.GND | v46.33,11.28 46.33,12.34 R13.1 | 47.09,3.5 v47.09,4.12 | v53.19,12.95 v54.71,14.48
  Bottom 0.152: SW3.P$1 76.35,19.2 v75.29,18.14 63.86,18.14 60.2,14.48 v54.71,14.48 | v70.26,6.55 72.08,6.55 73.15,5.49 J5.2 73.3,5.33 76.81,1.83 79.55,1.83 80.16,2.44 80.16,5.64 78.03,7.77 v78.03,13.41 | v27.58,5.03 34.75,5.03 37.95,1.83 v44.04,1.83 | v47.09,4.12 47.09,9.14 46.33,9.91 v46.33,11.28 48.01,12.95 v53.19,12.95
V+  (via drill 0.35)
  Top 0.152: 20.27,14.94 20.27,15.24 IC6.8 20.27,14.94 | 20.27,14.94 20.57,14.63 21.95,14.63 22.1,14.78 | 22.1,14.78 22.1,15.24 IC6.5 | 22.1,14.78 23.01,13.87 25.6,13.87 C10.1 25.76,13.87 25.76,18.59 26.21,19.05 37.19,19.05 39.17,17.07 39.17,16.31 39.78,15.7 45.26,15.7 C11.1 45.41,15.7 v46.79,15.7 | 20.27,14.94 19.66,14.33 16.15,14.33 16,14.48 16,15.7 16.31,16 17.68,16 19.96,18.29 20.42,18.29 R18.2 | 64.77,18.75 64.62,18.59 64.62,17.22 66.14,15.7 U$1.4 66.14,15.54 65.23,14.63 64.47,14.63 v60.81,10.97 | 64.77,18.75 68.12,18.75 68.73,18.14 C15.1 68.89,17.98 70.56,17.98 C6.1 70.71,18.14 71.48,18.9 75.44,18.9 78.94,15.39 78.94,11.28 LED2.A | v49.84,6.25 48.46,4.88 J4.VBUS | 64.77,18.75 59.13,18.75 D2.C 58.98,18.75 v57.91,17.68
  Bottom 0.152: v49.84,6.25 54.56,10.97 v60.81,10.97 | v46.79,15.7 55.93,15.7 v57.91,17.68
VBAT  (via drill 0.35)
  Top 0.152: v7.01,3.66 4.12,3.66 3.35,2.9 3.05,2.9 C8.1 | v19.36,4.88 20.27,4.88 20.42,5.03 C16.1 20.57,5.03 20.88,5.03 21.64,4.27 23.62,4.27 23.93,4.57 26.67,4.57 v26.98,4.27 | v58.52,5.18 59.13,4.57 59.13,4.12 L2.1 | v56.69,5.64 v56.69,10.21 56.69,10.97 57.61,11.89 IC5.5 | R12.2 83.06,6.1 79.7,6.1 79.55,6.25 78.79,6.25 78.18,5.64 78.18,5.03 79.4,3.81 79.55,3.81 80.16,3.2 80.16,2.44 79.55,1.83 73.91,1.83 73.3,2.44 J5.1 | v67.97,8.53 68.73,9.3 68.73,9.6 R16.1 | v54.71,10.21 53.95,10.97 R17.2 | v65.08,10.67 66.14,11.73 66.14,12.95 U$1.3
  Bottom 0.152: v7.01,3.66 9.6,3.66 10.21,3.05 17.53,3.05 v19.36,4.88 | v58.52,5.18 57.15,5.18 v56.69,5.64 52.27,1.22 38.1,1.22 35.05,4.27 v26.98,4.27 | v67.97,8.53 67.51,8.53 66.75,7.77 | 66.75,7.77 66.45,7.47 66.45,6.86 70.71,2.59 73.15,2.59 J5.1 | v54.71,10.21 v56.69,10.21 64.31,10.21 64.47,10.06 | 66.75,7.77 64.47,10.06 | 64.47,10.06 v65.08,10.67

### Text on the board
Top: piezo-rev-3-7
bPlace: PIEZO | HEADSET | ON | OFF | MIXER | PHONE